# EAGLE schematic v1 (EAGLE 9.0.0)
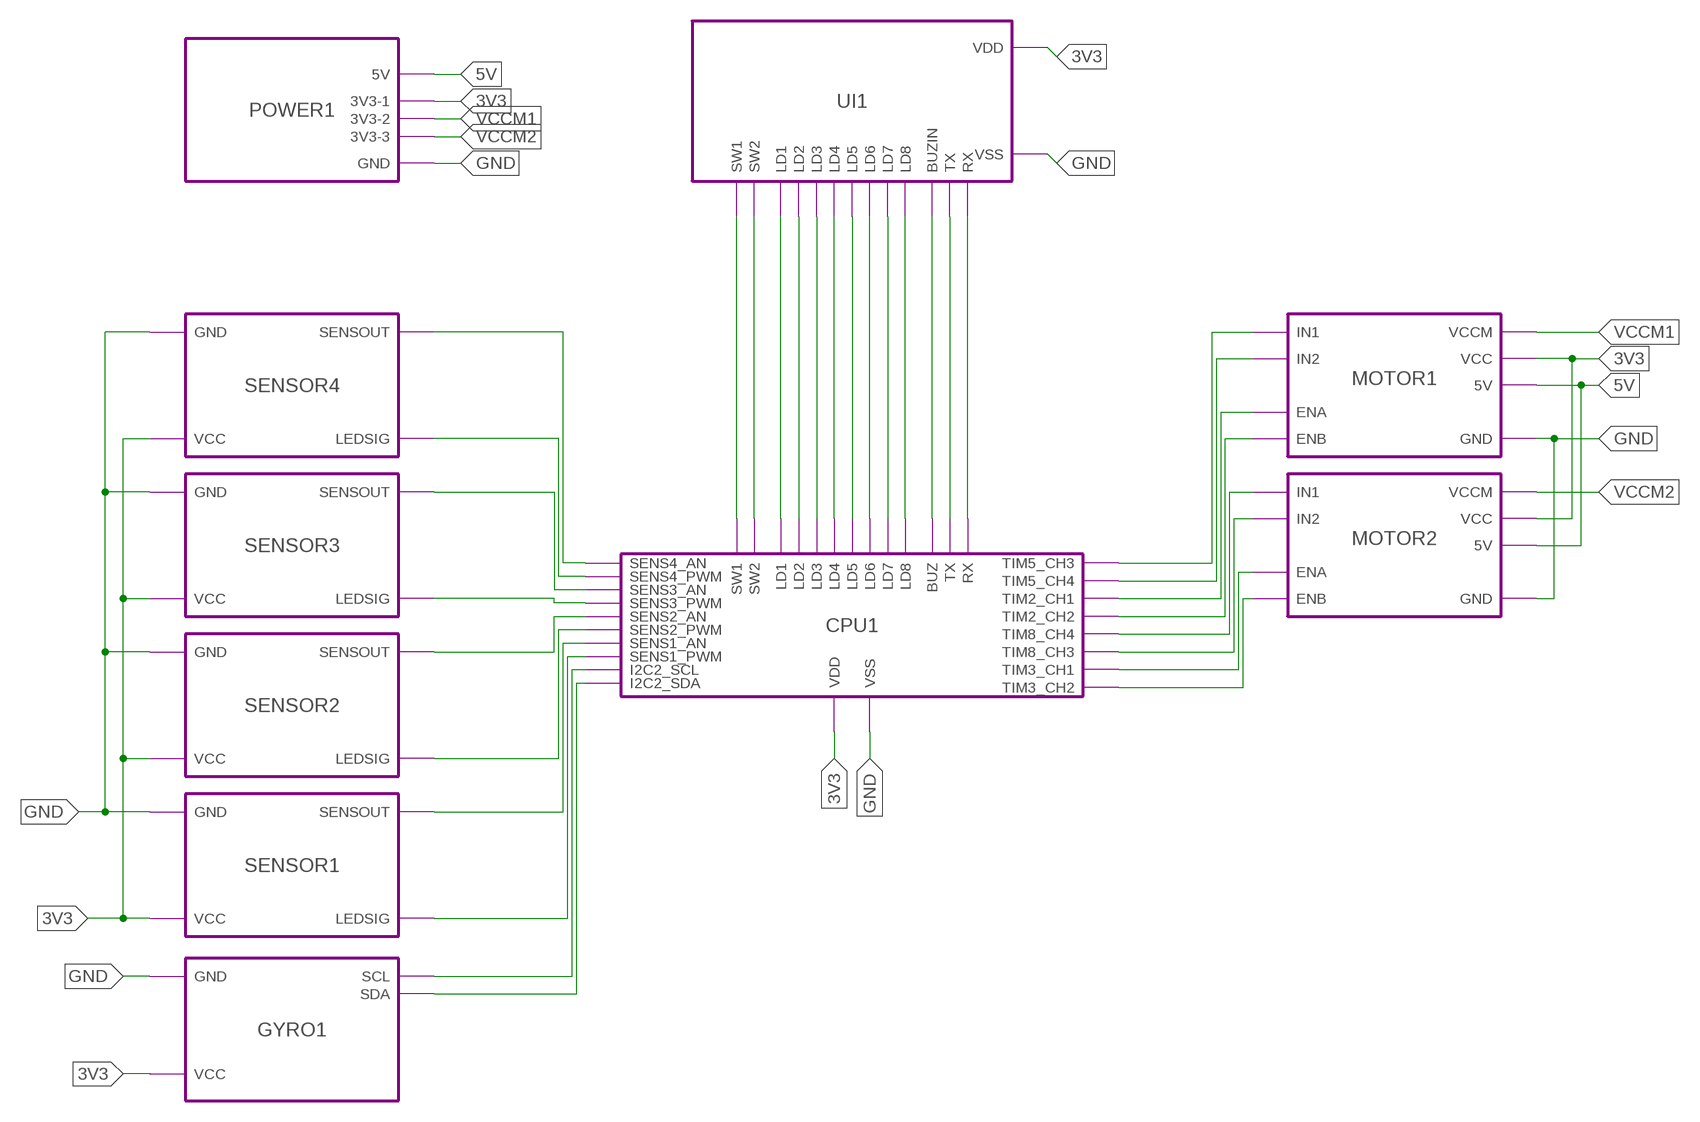
[diagram p0: schematic, sheet 1]

## Module instances
MOTOR1 = MOTORDRIVE
MOTOR2 = MOTORDRIVE
SENSOR1 = SENSOR
POWER1 = POWER
CPU1 = CPU
SENSOR2 = SENSOR
SENSOR3 = SENSOR
SENSOR4 = SENSOR
UI1 = UI
GYRO1 = GYRO

## Nets
3V3: port POWER1.3V3-1 SENSOR1.VCC SENSOR2.VCC SENSOR3.VCC SENSOR4.VCC UI1.VDD MOTOR2.VCC MOTOR1.VCC CPU1.VDD GYRO1.VCC
5V: port POWER1.5V MOTOR1.5V MOTOR2.5V
GND: port POWER1.GND SENSOR4.GND SENSOR3.GND SENSOR1.GND SENSOR2.GND MOTOR2.GND MOTOR1.GND UI1.VSS CPU1.VSS GYRO1.GND
N$1: port CPU1.TIM3_CH2 MOTOR2.ENB
N$2: port CPU1.TIM3_CH1 MOTOR2.ENA
N$3: port CPU1.TIM8_CH3 MOTOR2.IN2
N$4: port CPU1.TIM2_CH2 MOTOR1.ENB
N$5: port CPU1.TIM8_CH4 MOTOR2.IN1
N$6: port CPU1.TIM2_CH1 MOTOR1.ENA
N$7: port CPU1.TIM5_CH4 MOTOR1.IN2
N$8: port CPU1.TIM5_CH3 MOTOR1.IN1
N$9: port CPU1.LD1 UI1.LD1
N$10: port UI1.LD2 CPU1.LD2
N$11: port UI1.LD3 CPU1.LD3
N$12: port CPU1.BUZ UI1.BUZIN
N$13: port CPU1.SW1 UI1.SW1
N$14: port CPU1.SW2 UI1.SW2
N$15: port GYRO1.SDA CPU1.I2C2_SDA
N$16: port GYRO1.SCL CPU1.I2C2_SCL
N$17: port SENSOR1.LEDSIG CPU1.SENS1_PWM
N$18: port SENSOR2.LEDSIG CPU1.SENS2_PWM
N$19: port SENSOR1.SENSOUT CPU1.SENS1_AN
N$20: port SENSOR2.SENSOUT CPU1.SENS2_AN
N$21: port CPU1.SENS3_PWM SENSOR3.LEDSIG
N$22: port SENSOR3.SENSOUT CPU1.SENS3_AN
N$23: port CPU1.SENS4_PWM SENSOR4.LEDSIG
N$24: port CPU1.SENS4_AN SENSOR4.SENSOUT
N$25: port UI1.TX CPU1.TX
N$26: port CPU1.RX UI1.RX
N$27: port CPU1.LD4 UI1.LD4
N$28: port UI1.LD5 CPU1.LD5
N$29: port CPU1.LD6 UI1.LD6
N$30: port UI1.LD7 CPU1.LD7
N$31: port CPU1.LD8 UI1.LD8
VCCM1: port POWER1.3V3-2 MOTOR1.VCCM
VCCM2: port POWER1.3V3-3 MOTOR2.VCCM

## Library data of the parts

## Module MOTORDRIVE
Ports: VCC(pwr) IN2(in) IN1(in) VCCM(pwr) GND(pwr) 5V(pwr) ENB(out) ENA(out)
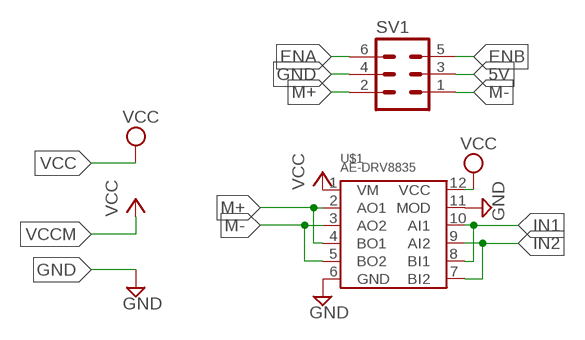
[diagram p1: schematic, module MOTORDRIVE, sheet 1]

### Parts
SV1  ML6  [ML6]
U$1  AE-DRV8835  [DIP_12]

### Nets
5V: SV1.3
ENA: SV1.6
ENB: SV1.5
GND: SV1.4 U$1.6(GND) U$1.11(MOD)
IN1: U$1.8(BI1) U$1.10(AI1)
IN2: U$1.7(BI2) U$1.9(AI2)
M+: SV1.2 U$1.2(AO1) U$1.4(BO1)
M-: SV1.1 U$1.3(AO2) U$1.5(BO2)
VCC: U$1.12(VCC)
VCCM: U$1.1(VM) ; supply symbol labelled VCC

### Library data of the parts
SV1 = con-ml:ML6: HARTING; OC_FARNELL: unknown; OC_NEWARK: unknown
U$1 = drv8835:AE-DRV8835

## Module SENSOR
Ports: VCC(pwr) GND(pwr) LEDSIG(in) SENSOUT(out)
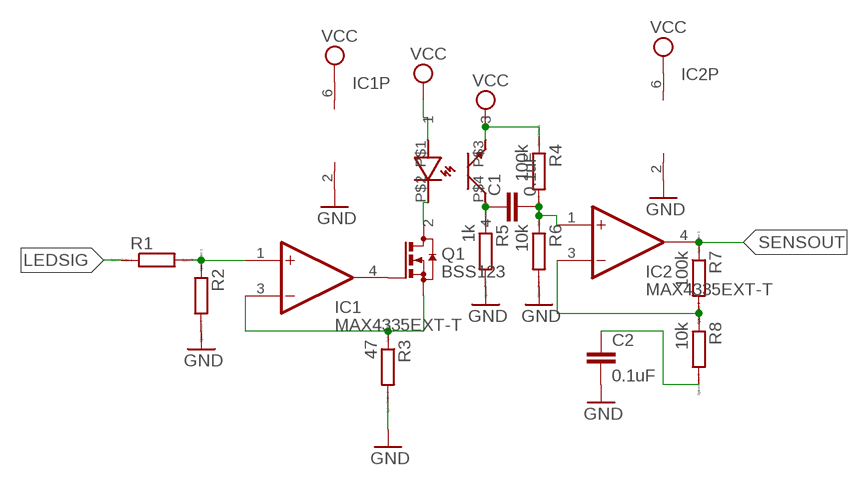
[diagram p2: schematic, module SENSOR, sheet 1]

### Parts
C1  0.1uF  0.1UF-0603-25V-(+80/-20%)  [0603]
C2  0.1uF  0.1UF-0603-25V-(+80/-20%)  [0603]
IC1  MAX4335EXT-T  [SOT23-6L]
IC2  MAX4335EXT-T  [SOT23-6L]
Q1  BSS123  [SOT23]
R1  RR0603  [R0603]
R2  RR0603  [R0603]
R3  47  RR0603  [R0603]
R4  100k  RR0603  [R0603]
R5  1k  RR0603  [R0603]
R6  10k  RR0603  [R0603]
R7  100k  RR0603  [R0603]
R8  10k  RR0603  [R0603]
U$1  LBR-127HLD  [LBR-127HLD]

### Nets
GND: C2.2 IC1.2(V-) IC2.2(V-) R2.2 R3.2 R5.2 R6.2
LEDSIG: R1.1
N$1: IC1.1(+IN) R1.2 R2.1
N$2: IC1.3(-IN) Q1.2(S) R3.1
N$3: IC1.4(OUT) Q1.1(G)
N$4: C1.2 IC2.1(+IN) R4.2 R6.1
N$5: Q1.3(D) U$1.P$2
N$7: IC2.3(-IN) R7.2 R8.1
N$8: C2.1 R8.2
N$9: C1.1 R5.1 U$1.P$4
SENSOUT: IC2.4(OUT) R7.1
VCC: IC1.6(V+) IC2.6(V+) R4.1 U$1.P$1 U$1.P$3

### Library data of the parts
C1 C2 = SparkFun-Capacitors:0.1UF: 0.1µF ceramic capacitors A capacitor is a passive two-terminal electrical component used to store electrical energy temporarily in an electric field.; PROD_ID: CAP-00810
IC1 IC2 = maxim:MAX4335: 50mA IOUT, Rail-to-Rail I/O Op Amp Source: http://datasheets.maxim-ic.com/en/ds/MAX4335-MAX4338.pdf; OC_FARNELL: unknown; OC_NEWARK: unknown
Q1 = transistor-small-signal:BSS123: N-CHANNEL MOS FET
R1-R8 = eagle-ltspice:R: RESISTOR, European symbol; SPICEMODEL: NONE; SPICEPREFIX: R
U$1 = phoitorteavht:LBR-127HLD

## Module 3V3
Ports: 7V4(pwr) GND(pwr) 3V3(pwr)
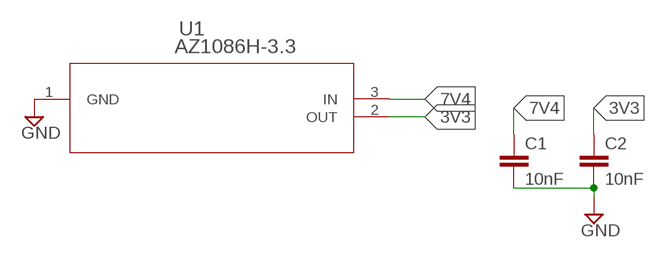
[diagram p3: schematic, module 3V3, sheet 1]

### Parts
C1  10nF  10NF-0603-50V-10%  [0603]
C2  10nF  10NF-0603-50V-10%  [0603]
U1  AZ1086H-3.3  [SOT-223_ST]

### Nets
3V3: C2.1 U1.2(OUT)
7V4: C1.1 U1.3(IN)
GND: C1.2 C2.2 U1.1(GND)

### Library data of the parts
C1 C2 = SparkFun-Capacitors:10NF: 0.01uF/10nF/10,000pF ceramic capacitors A capacitor is a passive two-terminal electrical component used to store electrical energy temporarily in an electric field. CAP-09321; PROD_ID: CAP-00867
U1 = AZ1086H-3.3:AZ1086H-3.3; MANUFACTURER_PART_NUMBER: LT3092EST#PBF; VENDOR: Linear Technology

## Module 5V
Ports: 7V4(pwr) 5V(pwr) GND(pwr)
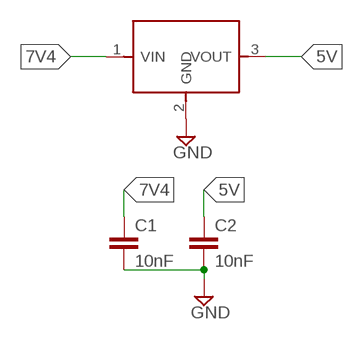
[diagram p4: schematic, module 5V, sheet 1]

### Parts
C1  10nF  10NF-0603-50V-10%  [0603]
C2  10nF  10NF-0603-50V-10%  [0603]
U$1  NJM7805  [TO-252-3]

### Nets
5V: C2.1 U$1.3(VOUT)
7V4: C1.1 U$1.1(VIN)
GND: C1.2 C2.2 U$1.2(GND)

### Library data of the parts
C1 C2 = SparkFun-Capacitors:10NF: 0.01uF/10nF/10,000pF ceramic capacitors A capacitor is a passive two-terminal electrical component used to store electrical energy temporarily in an electric field. CAP-09321; PROD_ID: CAP-00867
U$1 = NJM7805:NJM7805

## Module POWER
Ports: GND(pwr) 5V(pwr) 3V3-1(pwr) 3V3-2(pwr) 3V3-3(pwr)
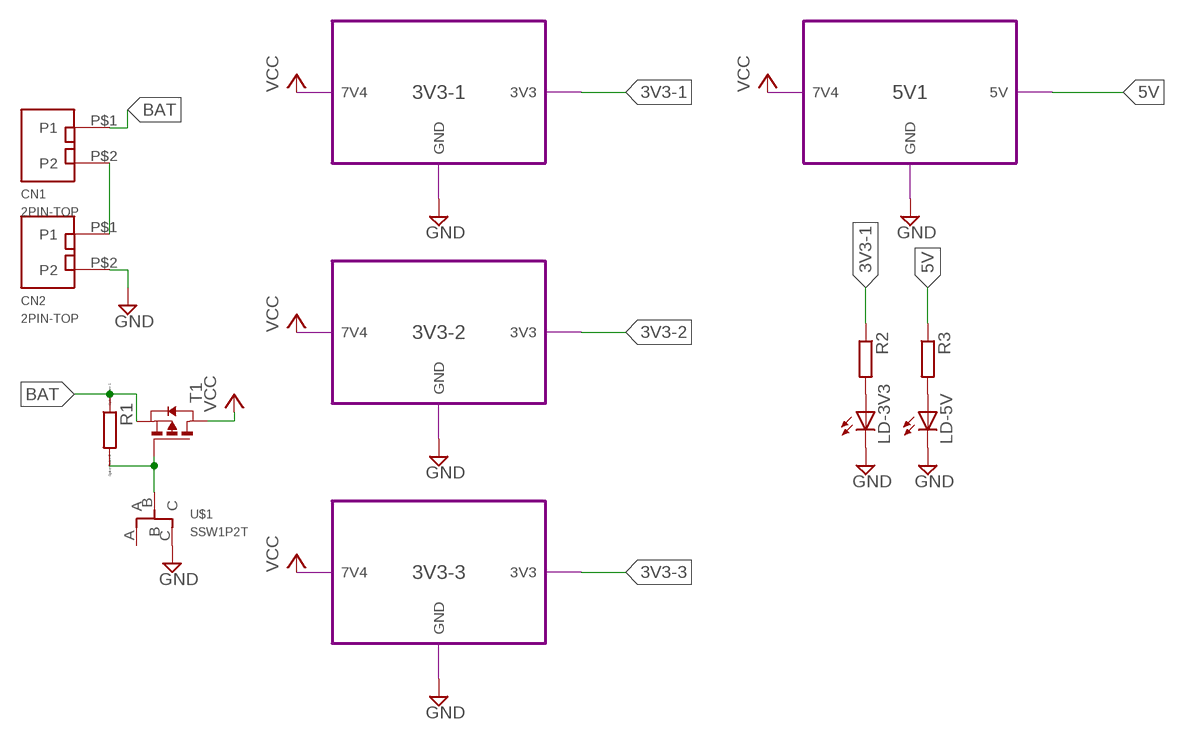
[diagram p5: schematic, module POWER, sheet 1]

### Parts
CN1  2PIN-TOP  [B02B-XASK-N]
CN2  2PIN-TOP  [B02B-XASK-N]
LD-3V3  LEDCHIP-LED0603  [CHIP-LED0603]
LD-5V  LEDCHIP-LED0603  [CHIP-LED0603]
R1  RR0603  [R0603]
R2  R-EU_R0603  [R0603]
R3  R-EU_R0603  [R0603]
T1  PMOSSOT23  [SOT-23]
U$1  SSW1P2T  [SSW1P2T]

### Module instances
3V3-1 = 3V3
3V3-2 = 3V3
5V1 = 5V
3V3-3 = 3V3

### Nets
3V3-1: R2.1 ; port 3V3-1.3V3
3V3-2: port 3V3-2.3V3
3V3-3: port 3V3-3.3V3
5V: R3.1 ; port 5V1.5V
BAT: CN1.P$1(P1) R1.1 T1.2(S)
GND: CN2.P$2(P2) LD-3V3.C LD-5V.C U$1.C ; port 3V3-2.GND 3V3-1.GND 5V1.GND 3V3-3.GND
N$1: R1.2 T1.3(G) U$1.B
N$2: CN1.P$2(P2) CN2.P$1(P1)
N$3: LD-3V3.A R2.2
N$4: LD-5V.A R3.2
VCC: T1.1(D) ; port 3V3-1.7V4 3V3-2.7V4 5V1.7V4 3V3-3.7V4
Unconnected: U$1.A

### Library data of the parts
CN1 CN2 = XA-connector_Kai:2PIN
LD-3V3 LD-5V = led:LED: LED OSRAM: - CHIPLED LG R971, LG N971, LY N971, LG Q971, LY Q971, LO R971, LY R971 LH N974, LH R974 LS Q976, LO Q976, LY Q976 LO Q996 - Hyper CHIPLED LW Q18S LB Q993, LB Q99A, LB R99A - SideLED LS A670, LO A670, LY A670, LG A670, LP A670 LB A673, LV A673, LT A673, LW A673 LH A674 LY A675 LS A676, LA A676, LO A676, LY A676, LW A676 LS A679, LY A679, LG A679 - Hyper Micro SIDELED® LS Y876, LA Y876, LO Y876, LY Y876 LT Y87S - SmartLED LW L88C, LW L88S LB L89C, LB L89S, LG L890 LS L89K, LO L89K, LY L89K LS L896, LA L896, LO L896, LY L896 - TOPLED LS T670, LO T670, LY T670, LG T670, LP T670 LSG T670, LSP T670, LSY T670, LOP T670, LYG T670 LG T671, LOG T671, LSG T671 LB T673, LV T673, LT T673, LW T673 LH T674 LS T676, LA T676, LO T676, LY T676, LB T676, LH T676, LSB T676, LW T676 LB T67C, LV T67C, LT T67C, LS T67K, LO T67K, LY T67K, LW E67C LS E67B, LA E67B, LO E67B, LY E67B, LB E67C, LV E67C, LT E67C LW T67C LS T679, LY T679, LG T679 LS T770, LO T770, LY T770, LG T770, LP T770 LB T773, LV T773, LT T773, LW T773 LH T774 LS E675, LA E675, LY E675, LS T675 LS T776, LA T776, LO T776, LY T776, LB T776 LHGB T686 LT T68C, LB T68C - Hyper Mini TOPLED® LB M676 - Mini TOPLED Santana® LG M470 LS M47K, LO M47K, LY M47K Source: http://www.osram.convergy.de LUXEON: - LUMILED® LXK2-PW12-R00, LXK2-PW12-S00, LXK2-PW14-U00, LXK2-PW14-V00 LXK2-PM12-R00, LXK2-PM12-S00, LXK2-PM14-U00 LXK2-PE12-Q00, LXK2-PE12-R00, LXK2-PE12-S00, LXK2-PE14-T00, LXK2-PE14-U00 LXK2-PB12-K00, LXK2-PB12-L00, LXK2-PB12-M00, LXK2-PB14-N00, LXK2-PB14-P00, LXK2-PB14-Q00 LXK2-PR12-L00, LXK2-PR12-M00, LXK2-PR14-Q00, LXK2-PR14-R00 LXK2-PD12-Q00, LXK2-PD12-R00, LXK2-PD12-S00 LXK2-PH12-R00, LXK2-PH12-S00 LXK2-PL12-P00, LXK2-PL12-Q00, LXK2-PL12-R00 Source: www.luxeon.com KINGBRIGHT: KA-3528ASYC Source: www.kingbright.com
R1 = eagle-ltspice:R: RESISTOR, European symbol; SPICEMODEL: NONE; SPICEPREFIX: R
R2 R3 = rcl:R-EU_: RESISTOR, European symbol; SPICEPREFIX: R
T1 = zetex:PMOSSOT23: MOS FET; OC_FARNELL: unknown; OC_NEWARK: unknown
U$1 = ssw1p2t:SSW1P2T

## Module CPU
Ports: VDD(pwr) VSS(pwr) TIM2_CH1(in) TIM2_CH2(in) TIM3_CH1(in) TIM3_CH2(in) TIM8_CH3(out) TIM8_CH4(out) TIM5_CH4(out) TIM5_CH3(out) LD1(out) LD2(out) LD3(out) BUZ(out) SW1(in) SW2(in) I2C2_SDA(io) I2C2_SCL(io) SENS1_PWM(io) SENS2_PWM(io) SENS1_AN(io) SENS2_AN(io) SENS3_PWM(io) SENS3_AN(io) SENS4_PWM(io) SENS4_AN(io) TX(out) RX(in) LD4(out) LD5(out) LD6(out) LD7(out) LD8(out)
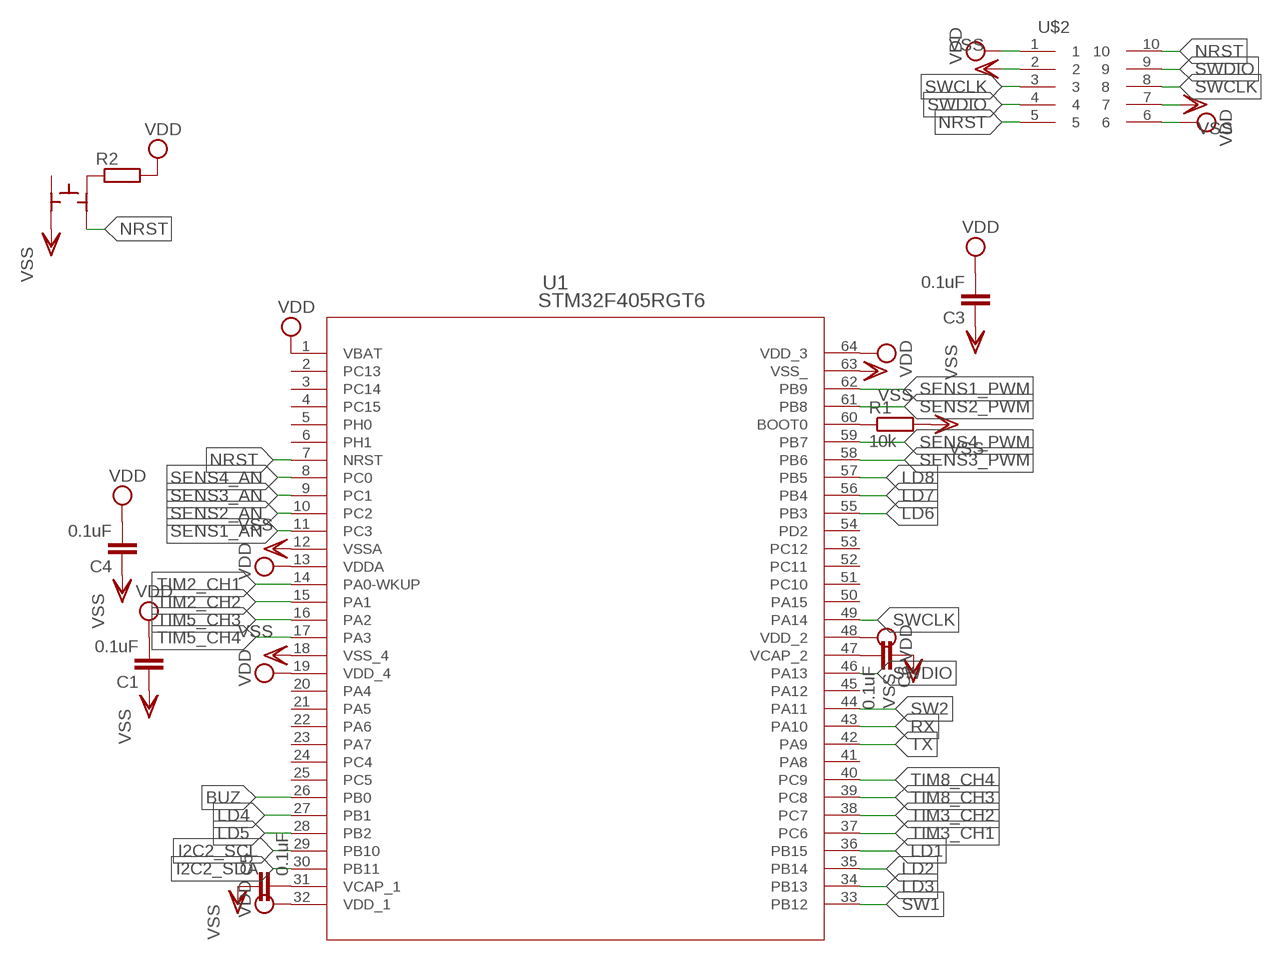
[diagram p6: schematic, module CPU, sheet 1]

### Parts
C1  0.1uF  0.1UF-0603-25V-(+80/-20%)  [0603]
C3  0.1uF  0.1UF-0603-25V-(+80/-20%)  [0603]
C4  0.1uF  0.1UF-0603-25V-(+80/-20%)  [0603]
C5  0.1uF  0.1UF-0603-25V-(+80/-20%)  [0603]
C6  0.1uF  0.1UF-0603-25V-(+80/-20%)  [0603]
R1  10k  R-EU_R0603  [R0603]
R2  R-EU_R0603  [R0603]
U1  STM32F405RGT6  [LQFP-64]
U$1  SKRPACE010  [SKRPACE010]
U$2  PINHEAD_10_127  [PINHEAD]

### Nets
BUZ: U1.26(PB0)
I2C2_SCL: U1.29(PB10)
I2C2_SDA: U1.30(PB11)
LD1: U1.36(PB15)
LD2: U1.35(PB14)
LD3: U1.34(PB13)
LD4: U1.27(PB1)
LD5: U1.28(PB2)
LD6: U1.55(PB3)
LD7: U1.56(PB4)
LD8: U1.57(PB5)
N$1: R1.1 U1.60(BOOT0)
N$2: R2.1 U$1.1
N$3: C5.2 U1.31(VCAP_1)
N$4: C6.2 U1.47(VCAP_2)
NRST: U1.7(NRST) U$1.2 U$2.5 U$2.10
RX: U1.43(PA10)
SENS1_AN: U1.11(PC3)
SENS1_PWM: U1.62(PB9)
SENS2_AN: U1.10(PC2)
SENS2_PWM: U1.61(PB8)
SENS3_AN: U1.9(PC1)
SENS3_PWM: U1.58(PB6)
SENS4_AN: U1.8(PC0)
SENS4_PWM: U1.59(PB7)
SW1: U1.33(PB12)
SW2: U1.44(PA11)
SWCLK: U1.49(PA14) U$2.3 U$2.8
SWDIO: U1.46(PA13) U$2.4 U$2.9
TIM2_CH1: U1.14(PA0-WKUP)
TIM2_CH2: U1.15(PA1)
TIM3_CH1: U1.37(PC6)
TIM3_CH2: U1.38(PC7)
TIM5_CH3: U1.16(PA2)
TIM5_CH4: U1.17(PA3)
TIM8_CH3: U1.39(PC8)
TIM8_CH4: U1.40(PC9)
TX: U1.42(PA9)
VDD: C1.2 C3.2 C4.2 R2.2 U1.1(VBAT) U1.13(VDDA) U1.19(VDD_4) U1.32(VDD_1) U1.48(VDD_2) U1.64(VDD_3) U$2.1 U$2.6
VSS: C1.1 C3.1 C4.1 C5.1 C6.1 R1.2 U1.12(VSSA) U1.18(VSS_4) U1.63(VSS_) U$1.4 U$2.2 U$2.7
Unconnected: U1.2(PC13) U1.3(PC14) U1.4(PC15) U1.5(PH0) U1.6(PH1) U1.20(PA4) U1.21(PA5) U1.22(PA6) U1.23(PA7) U1.24(PC4) U1.25(PC5) U1.41(PA8) U1.45(PA12) U1.50(PA15) U1.51(PC10) U1.52(PC11) U1.53(PC12) U1.54(PD2) U$1.3

### Library data of the parts
C1 C3-C6 = SparkFun-Capacitors:0.1UF: 0.1µF ceramic capacitors A capacitor is a passive two-terminal electrical component used to store electrical energy temporarily in an electric field.; PROD_ID: CAP-00810
R1 R2 = rcl:R-EU_: RESISTOR, European symbol; SPICEPREFIX: R
U1 = STM32F405RGT6:STM32F405RGT6; MANUFACTURER_PART_NUMBER: STM32F405RGT6; VENDOR: STMicroelectronics
U$1 = SMDtact:SKRPACE010
U$2 = pinhead:PINHEAD_10_127

## Module UI
Ports: VDD(pwr) VSS(pwr) SW1(out) SW2(out) LD1(in) LD2(in) LD3(in) BUZIN(in) TX(in) RX(out) LD4(in) LD5(in) LD6(in) LD7(in) LD8(in)
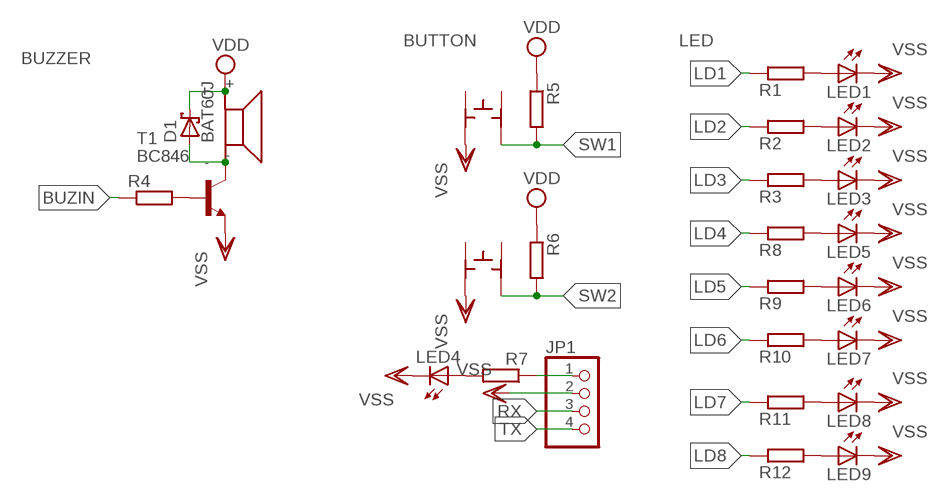
[diagram p7: schematic, module UI, sheet 1]

### Parts
D1  BAT60J  [SOD323_ST]
JP1  PINHD-1X4  [1X04]
LED1  LEDCHIP-LED0603  [CHIP-LED0603]
LED2  LEDCHIP-LED0603  [CHIP-LED0603]
LED3  LEDCHIP-LED0603  [CHIP-LED0603]
LED4  LEDCHIP-LED0603  [CHIP-LED0603]
LED5  LEDCHIP-LED0603  [CHIP-LED0603]
LED6  LEDCHIP-LED0603  [CHIP-LED0603]
LED7  LEDCHIP-LED0603  [CHIP-LED0603]
LED8  LEDCHIP-LED0603  [CHIP-LED0603]
LED9  LEDCHIP-LED0603  [CHIP-LED0603]
R1  R-EU_R0603  [R0603]
R2  R-EU_R0603  [R0603]
R3  R-EU_R0603  [R0603]
R4  R-EU_R0603  [R0603]
R5  R-EU_R0603  [R0603]
R6  R-EU_R0603  [R0603]
R7  R-EU_R0603  [R0603]
R8  R-EU_R0603  [R0603]
R9  R-EU_R0603  [R0603]
R10  R-EU_R0603  [R0603]
R11  R-EU_R0603  [R0603]
R12  R-EU_R0603  [R0603]
T1  BC846  [SOT23]
U$1  UGCT725AN4  [UGCT7525AN4]
U$2  SKRPACE010  [SKRPACE010]
U$3  SKRPACE010  [SKRPACE010]

### Nets
BUZIN: R4.1
LD1: R1.1
LD2: R2.1
LD3: R3.1
LD4: R8.1
LD5: R9.1
LD6: R10.1
LD7: R11.1
LD8: R12.1
N$1: LED1.A R1.2
N$2: LED2.A R2.2
N$3: LED3.A R3.2
N$4: D1.A T1.3(C) U$1.-
N$5: R4.2 T1.1(B)
N$6: JP1.1 R7.1
N$7: LED4.A R7.2
N$8: LED5.A R8.2
N$9: LED6.A R9.2
N$10: LED7.A R10.2
N$11: LED8.A R11.2
N$12: LED9.A R12.2
RX: JP1.3
SW1: R5.2 U$2.2
SW2: R6.2 U$3.2
TX: JP1.4
VDD: D1.C R5.1 R6.1 U$1.+
VSS: JP1.2 LED1.C LED2.C LED3.C LED4.C LED5.C LED6.C LED7.C LED8.C LED9.C T1.2(E) U$2.4 U$3.4
Unconnected: U$2.1 U$2.3 U$3.1 U$3.3

### Notes on the sheet
- BUTTON | LED
- BUZZER

### Library data of the parts
D1 = diode:BAT60J: Schottky barrier diode Source: www.st.com, BAT60J.pdf
JP1 = pinhead:PINHD-1X4: PIN HEADER
LED1-LED9 = led:LED: LED OSRAM: - CHIPLED LG R971, LG N971, LY N971, LG Q971, LY Q971, LO R971, LY R971 LH N974, LH R974 LS Q976, LO Q976, LY Q976 LO Q996 - Hyper CHIPLED LW Q18S LB Q993, LB Q99A, LB R99A - SideLED LS A670, LO A670, LY A670, LG A670, LP A670 LB A673, LV A673, LT A673, LW A673 LH A674 LY A675 LS A676, LA A676, LO A676, LY A676, LW A676 LS A679, LY A679, LG A679 - Hyper Micro SIDELED® LS Y876, LA Y876, LO Y876, LY Y876 LT Y87S - SmartLED LW L88C, LW L88S LB L89C, LB L89S, LG L890 LS L89K, LO L89K, LY L89K LS L896, LA L896, LO L896, LY L896 - TOPLED LS T670, LO T670, LY T670, LG T670, LP T670 LSG T670, LSP T670, LSY T670, LOP T670, LYG T670 LG T671, LOG T671, LSG T671 LB T673, LV T673, LT T673, LW T673 LH T674 LS T676, LA T676, LO T676, LY T676, LB T676, LH T676, LSB T676, LW T676 LB T67C, LV T67C, LT T67C, LS T67K, LO T67K, LY T67K, LW E67C LS E67B, LA E67B, LO E67B, LY E67B, LB E67C, LV E67C, LT E67C LW T67C LS T679, LY T679, LG T679 LS T770, LO T770, LY T770, LG T770, LP T770 LB T773, LV T773, LT T773, LW T773 LH T774 LS E675, LA E675, LY E675, LS T675 LS T776, LA T776, LO T776, LY T776, LB T776 LHGB T686 LT T68C, LB T68C - Hyper Mini TOPLED® LB M676 - Mini TOPLED Santana® LG M470 LS M47K, LO M47K, LY M47K Source: http://www.osram.convergy.de LUXEON: - LUMILED® LXK2-PW12-R00, LXK2-PW12-S00, LXK2-PW14-U00, LXK2-PW14-V00 LXK2-PM12-R00, LXK2-PM12-S00, LXK2-PM14-U00 LXK2-PE12-Q00, LXK2-PE12-R00, LXK2-PE12-S00, LXK2-PE14-T00, LXK2-PE14-U00 LXK2-PB12-K00, LXK2-PB12-L00, LXK2-PB12-M00, LXK2-PB14-N00, LXK2-PB14-P00, LXK2-PB14-Q00 LXK2-PR12-L00, LXK2-PR12-M00, LXK2-PR14-Q00, LXK2-PR14-R00 LXK2-PD12-Q00, LXK2-PD12-R00, LXK2-PD12-S00 LXK2-PH12-R00, LXK2-PH12-S00 LXK2-PL12-P00, LXK2-PL12-Q00, LXK2-PL12-R00 Source: www.luxeon.com KINGBRIGHT: KA-3528ASYC Source: www.kingbright.com
R1-R12 = rcl:R-EU_: RESISTOR, European symbol; SPICEPREFIX: R
T1 = transistor-neu-to92:BC846: NPN TRANSISTOR
U$1 = UGCT7525AN4:UGCT725AN4
U$2 U$3 = SMDtact:SKRPACE010

## Module GYRO
Ports: VCC(io) GND(io) SCL(io) SDA(io)
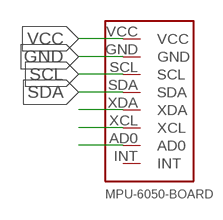
[diagram p8: schematic, module GYRO, sheet 1]

### Parts
U$1  MPU-6050-BOARD  [BOARD]

### Nets
GND: U$1.GND
N$8: U$1.XDA
N$9: U$1.XCL
N$10: U$1.AD0
SCL: U$1.SCL
SDA: U$1.SDA
VCC: U$1.VCC
Unconnected: U$1.INT

### Library data of the parts
U$1 = MPU-6050:MPU-6050-BOARD

## Module LIPOCHGER
Ports: 
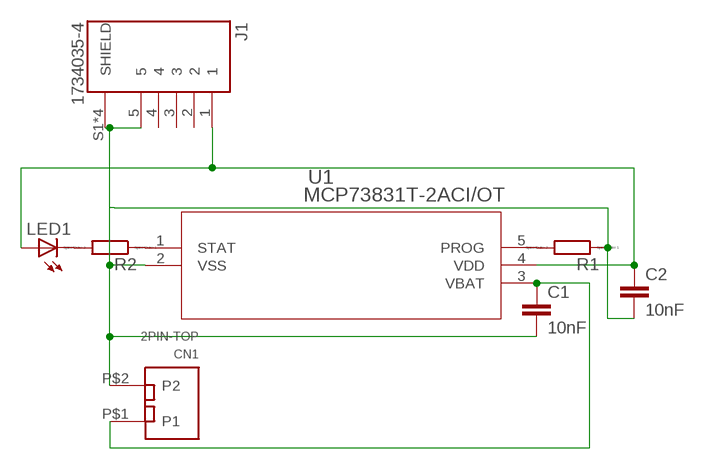
[diagram p9: schematic, module LIPOCHGER, sheet 1]

### Parts
C1  10nF  10NF-0603-50V-10%  [0603]
C2  10nF  10NF-0603-50V-10%  [0603]
CN1  2PIN-TOP  [B02B-XASK-N]
J1  1734035-4  [J_SMD_1734035-4-5_0.8_9.9_8.85_3.9]
LED1  LEDCHIPLED_0603  [CHIPLED_0603]
R1  RR0603  [R0603]
R2  RR0603  [R0603]
U1  MCP73831T-2ACI/OT  [SOT-23-5_MC]

### Nets
N$1: R1.2 U1.5(PROG)
N$2: R2.1 U1.1(STAT)
N$3: LED1.C R2.2
N$4: C1.2 C2.2 CN1.P$2(P2) J1.5 J1.S1(SHIELD) J1.S2(SHIELD) J1.S3(SHIELD) J1.S4(SHIELD) R1.1 U1.2(VSS)
N$5: C2.1 J1.1 LED1.A U1.4(VDD)
N$6: C1.1 CN1.P$1(P1) U1.3(VBAT)
Unconnected: J1.2 J1.3 J1.4

### Library data of the parts
C1 C2 = SparkFun-Capacitors:10NF: 0.01uF/10nF/10,000pF ceramic capacitors A capacitor is a passive two-terminal electrical component used to store electrical energy temporarily in an electric field. CAP-09321; PROD_ID: CAP-00867
CN1 = XA-connector_Kai:2PIN
J1 = 1734035-4:1734035-4: Conn Mini USB 2.0 Type B RCP 5 POS 0.8mm Solder RA SMD 5 Terminal 1 Port Automotive T/R; CENTERLINE_PITCH: .8 mm[.031 in]; COMMENT: 1734035-4; DESCRIPTION: Mini USB,R/A,SMT,B Type,pbFree; DIGI-KEY_PART_NUMBER: A121554CT-ND; DIGI-KEY_PURCHASE_URL: https://www.digikey.jp/product-detail/en/te-connectivity-amp-connectors/1734035-4/A121554CT-ND/5246531?utm_source=snapeda&utm_medium=aggregator&utm_campaign=symbol; EU_ROHS_COMPLIANCE: Compliant; MF: TE Connectivity; MP: 1734035-4; NUMBER_OF_POSITIONS: 5; PACKAGE: None; PRODUCT_TYPE: Connector; TE_PURCHASE_URL: https://www.te.com/usa-en/product-1734035-4.html?te_bu=Cor&te_type=disp&te_campaign=seda_glo_cor-seda-global-disp-prtnr-fy19-seda-model-bom-cta_sma-317_1&elqCampaignId=32493
LED1 = led:LED: LED OSRAM: - CHIPLED LG R971, LG N971, LY N971, LG Q971, LY Q971, LO R971, LY R971 LH N974, LH R974 LS Q976, LO Q976, LY Q976 LO Q996 - Hyper CHIPLED LW Q18S LB Q993, LB Q99A, LB R99A - SideLED LS A670, LO A670, LY A670, LG A670, LP A670 LB A673, LV A673, LT A673, LW A673 LH A674 LY A675 LS A676, LA A676, LO A676, LY A676, LW A676 LS A679, LY A679, LG A679 - Hyper Micro SIDELED® LS Y876, LA Y876, LO Y876, LY Y876 LT Y87S - SmartLED LW L88C, LW L88S LB L89C, LB L89S, LG L890 LS L89K, LO L89K, LY L89K LS L896, LA L896, LO L896, LY L896 - TOPLED LS T670, LO T670, LY T670, LG T670, LP T670 LSG T670, LSP T670, LSY T670, LOP T670, LYG T670 LG T671, LOG T671, LSG T671 LB T673, LV T673, LT T673, LW T673 LH T674 LS T676, LA T676, LO T676, LY T676, LB T676, LH T676, LSB T676, LW T676 LB T67C, LV T67C, LT T67C, LS T67K, LO T67K, LY T67K, LW E67C LS E67B, LA E67B, LO E67B, LY E67B, LB E67C, LV E67C, LT E67C LW T67C LS T679, LY T679, LG T679 LS T770, LO T770, LY T770, LG T770, LP T770 LB T773, LV T773, LT T773, LW T773 LH T774 LS E675, LA E675, LY E675, LS T675 LS T776, LA T776, LO T776, LY T776, LB T776 LHGB T686 LT T68C, LB T68C - Hyper Mini TOPLED® LB M676 - Mini TOPLED Santana® LG M470 LS M47K, LO M47K, LY M47K Source: http://www.osram.convergy.de LUXEON: - LUMILED® LXK2-PW12-R00, LXK2-PW12-S00, LXK2-PW14-U00, LXK2-PW14-V00 LXK2-PM12-R00, LXK2-PM12-S00, LXK2-PM14-U00 LXK2-PE12-Q00, LXK2-PE12-R00, LXK2-PE12-S00, LXK2-PE14-T00, LXK2-PE14-U00 LXK2-PB12-K00, LXK2-PB12-L00, LXK2-PB12-M00, LXK2-PB14-N00, LXK2-PB14-P00, LXK2-PB14-Q00 LXK2-PR12-L00, LXK2-PR12-M00, LXK2-PR14-Q00, LXK2-PR14-R00 LXK2-PD12-Q00, LXK2-PD12-R00, LXK2-PD12-S00 LXK2-PH12-R00, LXK2-PH12-S00 LXK2-PL12-P00, LXK2-PL12-Q00, LXK2-PL12-R00 Source: www.luxeon.com KINGBRIGHT: KA-3528ASYC Source: www.kingbright.com
R1 R2 = eagle-ltspice:R: RESISTOR, European symbol; SPICEMODEL: NONE; SPICEPREFIX: R
U1 = mcp73831:MCP73831T-2ACI/OT; MANUFACTURER_PART_NUMBER: MCP73831T2ACIOT; VENDOR: Microchip

## Module PINCHANGER
Ports: 
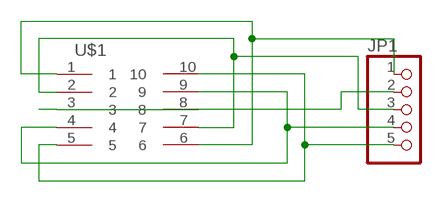
[diagram p10: schematic, module PINCHANGER, sheet 1]

### Parts
JP1  PINHD-1X5  [1X05]
U$1  PINHEAD_10_127  [PINHEAD]

### Nets
N$1: JP1.5 U$1.5 U$1.10
N$2: JP1.4 U$1.4 U$1.9
N$4: JP1.3 U$1.2 U$1.7
N$5: JP1.1 U$1.1 U$1.6
N$8: JP1.2 U$1.3 U$1.8

### Library data of the parts
JP1 = pinhead:PINHD-1X5: PIN HEADER
U$1 = pinhead:PINHEAD_10_127